# EAGLE design PowerShield v1-0 (EAGLE 6.5.0)
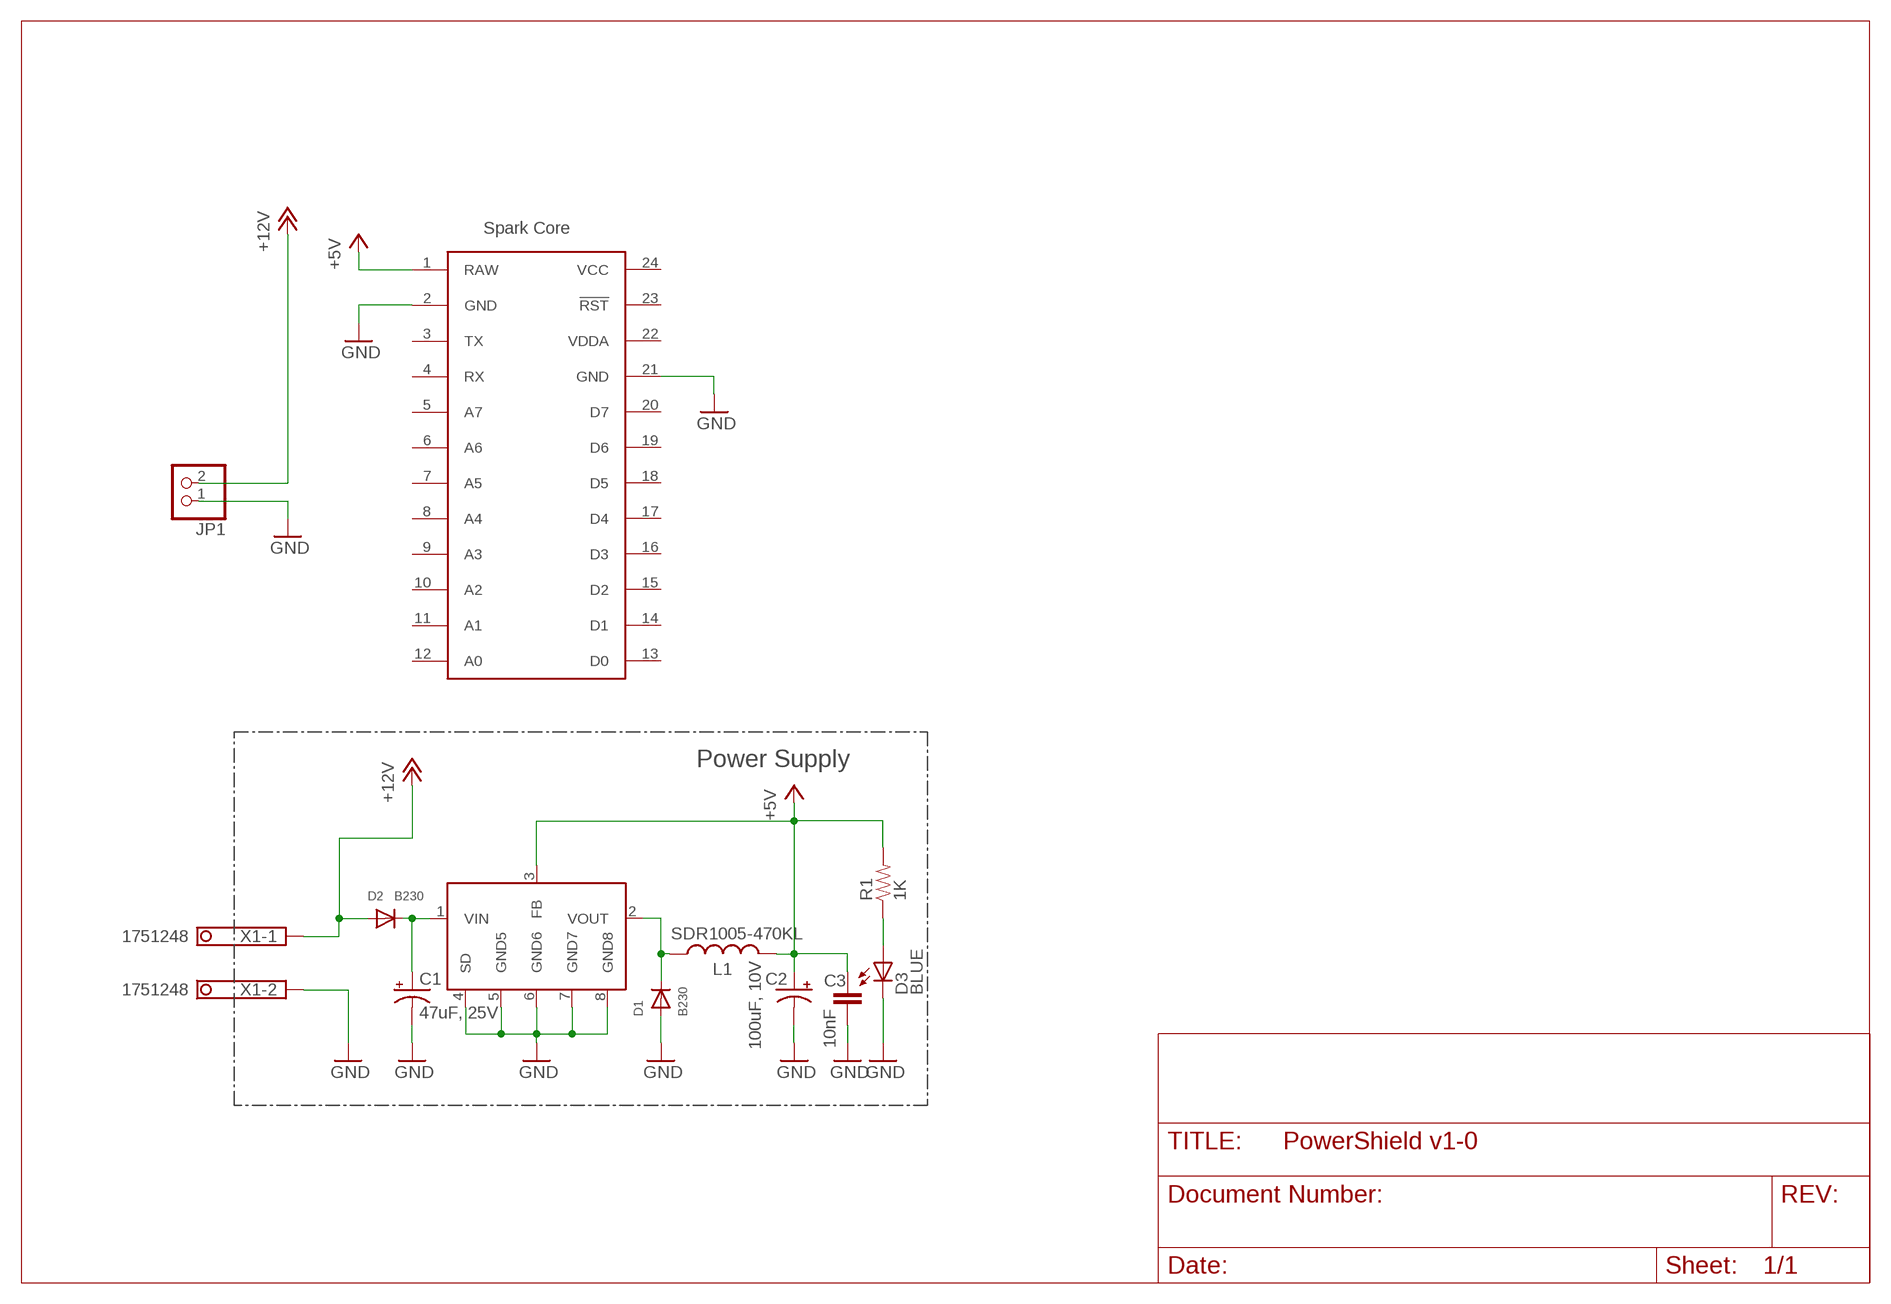
[diagram p0: schematic, sheet 1]

## Parts
C1  47uF, 25V  CAP_POLD  [PANASONIC_D]
C2  100uF, 10V  CAP_POLD  [PANASONIC_D]
C3  10nF  CAP0603-CAP  [0603-CAP]
D1  B230  DIODESMA  [SMADIODE]
D2  B230  DIODESMA  [SMADIODE]
D3  BLUE  LED0603  [LED-0603]
JP1  PINHD-1X2  [1X02]
L1  SDR1005-470KL  INDUCTOR-SPARKFUN  [INDUCTOR-SDR1005-470KL]
R1  1K  RESISTOR0603-RES  [0603-RES]
U1  AP1509-50SG-13  [SO08]
U$2  SPARK_CORECORE  [SPARK_CORE]
X1  1751248  [1751248]

## Nets
+5V: C2.+ C3.2 L1.P$2 R1.2 U1.3(FB) U$2.1(RAW)
+12V: D2.A JP1.2 X1.1
GND: C1.- C2.- C3.1 D1.A D3.C JP1.1 U1.4(SD) U1.5(GND5) U1.6(GND6) U1.7(GND7) U1.8(GND8) U$2.2(GND) U$2.21(GND) X1.2
N$1: D3.A R1.1
N$2: C1.+ D2.C U1.1(VIN)
N$34: D1.C L1.P$1 U1.2(VOUT)
Unconnected: U$2.3(TX) U$2.4(RX) U$2.5(A7) U$2.6(A6) U$2.7(A5) U$2.8(A4) U$2.9(A3) U$2.10(A2) U$2.11(A1) U$2.12(A0) U$2.13(D0) U$2.14(D1) U$2.15(D2) U$2.16(D3) U$2.17(D4) U$2.18(D5) U$2.19(D6) U$2.20(D7) U$2.23(!RST)

## Notes on the sheet
- Spark Core
- Power Supply

## Power pins joined to a net without a drawn wire
VCC: U$2.24(VCC)
VDDA: U$2.22(VDDA)

## Library data of the parts
C1 C2 = SparkFun-Capacitors:CAP_POL: Capacitor Polarized These are standard SMD and PTH capacitors. Normally 10uF, 47uF, and 100uF in electrolytic and tantalum varieties. Always verify the external diameter of the through hole cap, it varies with capacity, voltage, and manufacturer. The EIA devices should be standard.
C3 = SparkFun-Capacitors:CAP: Capacitor Standard 0603 ceramic capacitor, and 0.1" leaded capacitor.
D1 D2 = adafruit:DIODE: Diode SMADIODE - SMA Surface Mount Package 20V 1A Schottky Diode Digikey: 641-1014-6-ND DO-1N4148 - Through Hole Small Current Diode SOD-123 20V 1 A (.5mV Vf) Schottky Diode - Digikey: MBRX120TPMSCT-ND SOD-323 10V 570mA (.38mV Vf, 3ns) Schottky Diode - Digikey: ZLLS410CT-ND SOD-523 30V 30mA Schottky Diode (RB751S-40TE61) - Digikey: RB751S-40TE61CT-ND SOT23-R/W - SOT23 Package (R = Solder Paste/Reflow Ovens, W = Hand-Soldering) BAT54Film 40V 300mA - Digikey: 497-7162-1-ND
D3 = SparkFun-LED:LED: LEDs Standard schematic elements and footprints for 5mm, 3mm, 1206, and 0603 sized LEDs. 5mm - Spark Fun Electronics SKU : COM-00529 (and others)
JP1 = pinhead:PINHD-1X2: PIN HEADER
L1 = Spark:INDUCTOR-SPARKFUN: Inductors Basic Inductor/Choke - 0603 and 1206. Footprints are not proven and vary greatly between part numbers. SRN6045- 33uH, 20% 1.4A
R1 = SparkFun-Passives:RESISTOR: Resistor Basic schematic elements and footprints for 0603, 1206, and PTH resistors.
U1 = Spark:AP1509-50SG-13
U$2 = Spark:SPARK_CORE
X1 = con-phoenix-350:1751248: MKDS 1/ 2-3,5 Printklemme Nennstrom: 10 A Bemessungsspannung: 160 V Raster: 3,5 mm Polzahl: 2 Montageart: Löten Anschlussart: Schraubanschluss Anschlussrichtung vom Leiter zur Platine: 0° Source: http://eshop.phoenixcontact.com .. 1751248.pdf; OC_FARNELL: unknown; OC_NEWARK: unknown

## Board
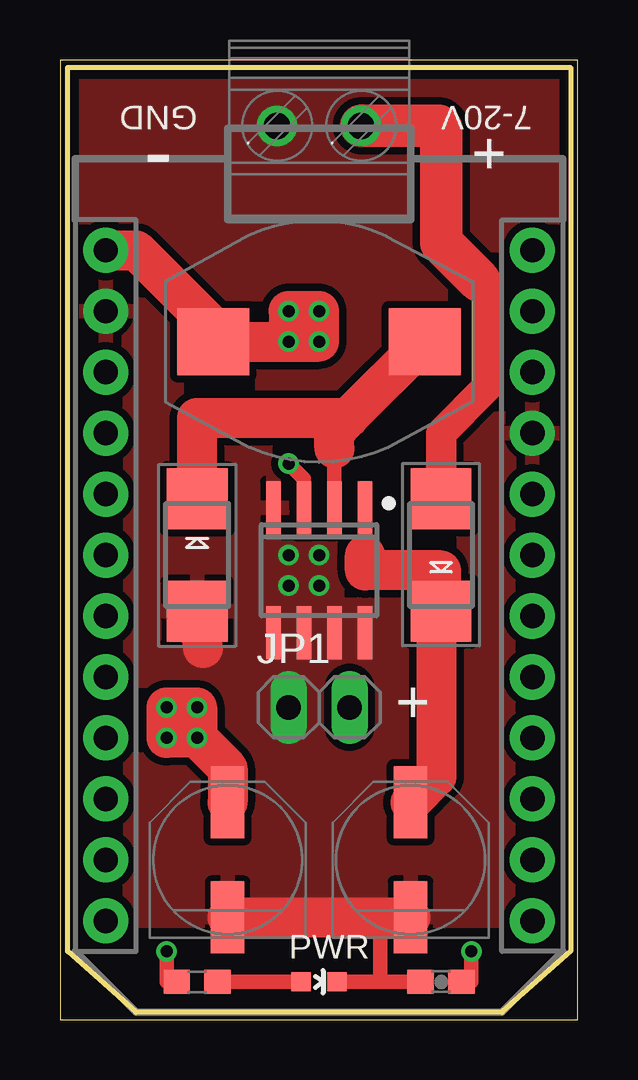
[diagram p1: board, top side]
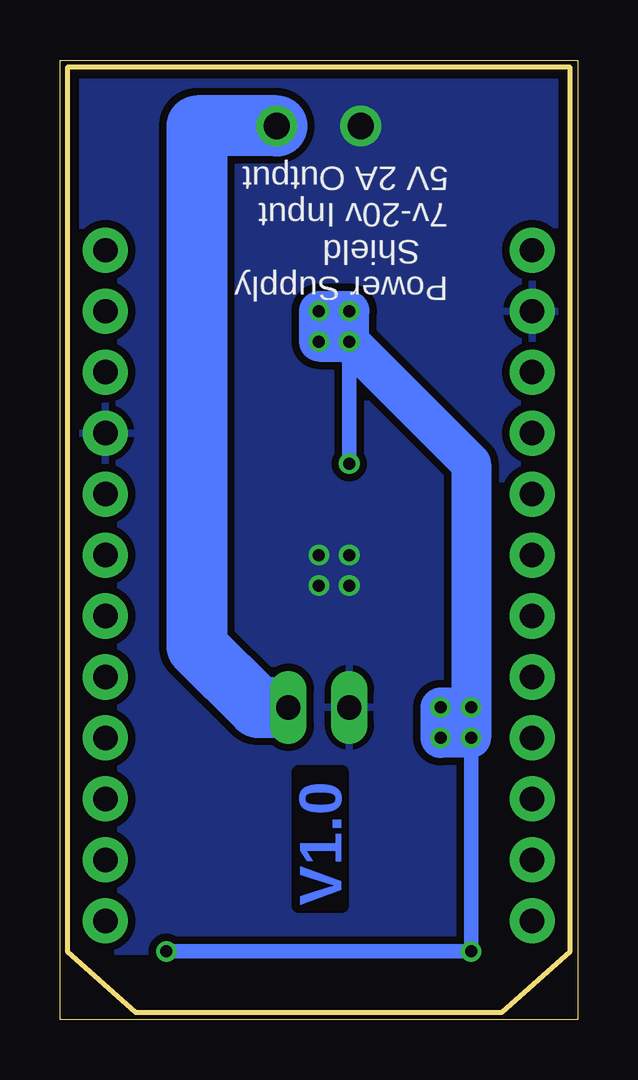
[diagram p2: board, bottom side, seen from below]

Size 21.58 x 39.99 mm. Coordinates in mm from the lower left corner, seen from the top.
Outline: 0,0 21.58,0 21.58,39.99 0,39.99 0,0
Outline: 0.32,39.69 21.27,39.69 21.27,2.86 18.41,0.32 3.17,0.32 0.32,2.86 0.32,39.69
Copper layers (1*16): Top 0.0356mm / dielectric 1.5011mm / Bottom 0.0356mm
Design rules "LaenPCBOrder *": minimum track width 6mil, minimum drill 13mil, track to track 6mil, track to pad 6mil, pad to pad 6mil, via to via 6mil, smd to smd 6mil, copper to edge 15mil, drill to drill 6mil, minimum pad ring 7mil, minimum via ring 7mil, stop-mask expansion 3mil, vias tented up to drill 21mil, thermal gap 10mil

### Footprints (pad centres in the part's own frame; a part is rotated, then mirrored left to right if it is on the bottom)
PANASONIC_D = smd 3 x 1.4: + 2.4,0; - -2.4,0
0603-CAP = smd 1.1 x 1: 1 -0.85,0; 2 0.85,0
SMADIODE = smd 2.54 x 2.54: A 2.349,0; C -2.349,0
LED-0603 = smd 0.8 x 0.8: A 0,-0.75; C 0,0.75
1X02 = drill 1.016 long: 1 -1.27,0; 2 1.27,0
INDUCTOR-SDR1005-470KL = smd 3 x 2.8: P$1 -4.4,0; P$2 4.4,0
0603-RES = smd 1.1 x 1: 1 -0.85,0; 2 0.85,0
SO08 = smd 0.6 x 2.2: 1 -1.905,-2.6; 2 -0.635,-2.6; 3 0.635,-2.6; 4 1.905,-2.6; 5 1.905,2.6; 6 0.635,2.6; 7 -0.635,2.6; 8 -1.905,2.6
SPARK_CORE = drill 1.016 pad 1.88: 1 -8.89,13.97; 2 -8.89,11.43; 3 -8.89,8.89; 4 -8.89,6.35; 5 -8.89,3.81; 6 -8.89,1.27; 7 -8.89,-1.27; 8 -8.89,-3.81; 9 -8.89,-6.35; 10 -8.89,-8.89; 11 -8.89,-11.43; 12 -8.89,-13.97; 13 8.89,-13.97; 14 8.89,-11.43; 15 8.89,-8.89; 16 8.89,-6.35; 17 8.89,-3.81; 18 8.89,-1.27; 19 8.89,1.27; 20 8.89,3.81; 21 8.89,6.35; 22 8.89,8.89; 23 8.89,11.43; 24 8.89,13.97
1751248 = drill 1.1 pad 1.7: 1 -1.75,-0.1; 2 1.75,-0.1

### Placement (x,y rotation side)
C1  14.61,6.67 90 top
C2  6.99,6.67 90 top
C3  15.88,1.59 0 top
D1  5.71,19.37 270 top
D2  15.88,19.37 90 top
D3  10.79,1.59 270 top
JP1  10.79,13.02 0 top
L1  10.79,28.26 180 top
R1  5.71,1.59 180 top
U1  10.79,18.73 180 top
U$2  10.79,18.1 0 top
X1  10.79,37.15 180 top

### Tracks (layer width: path | path; a pad name or v marks a point on that pad's centre or on a via)
+5V  (via drill 0.5)
  Top 0.61: 6.35,28.89 6.35,28.3 L1.P$2 | U1.3 10.16,22.54 v9.53,23.18 | R1.2 4.45,1.59 v4.45,2.86 | C3.2 17.14,1.59 v17.14,2.86
  Top 1.676: U$2.1 3.17,32.07 6.35,28.89 | L1.P$2 v9.53,28.26 | v9.53,28.26 v10.79,28.26 v10.79,29.53 v9.53,29.53 v9.53,28.26 | v4.45,13.02 v5.71,13.02 v5.71,11.75 | v5.71,11.75 v4.45,11.75 v4.45,13.02 | v4.45,13.02 v5.71,11.75 | v5.71,11.75 6.99,10.48 C2.+
  Bottom 0.61: v9.53,23.18 v9.53,28.26 | v4.45,11.75 v4.45,2.86 v17.14,2.86
  Bottom 1.676: v9.53,28.26 v9.53,29.53 v10.79,29.53 v10.79,28.26 v9.53,28.26 | v9.53,28.26 4.45,23.18 v4.45,13.02 | v4.45,13.02 v4.45,11.75 v5.71,11.75 v5.71,13.02 v4.45,13.02
+12V
  Top 1.27: D2.A 15.88,24.45 17.78,26.35 17.78,30.48 17.46,30.8
  Top 1.778: 17.46,30.8 15.88,32.38 15.88,37.15 15.78,37.25 X1.1
  Bottom 1.27: 12.7,13.02 JP1.2
  Bottom 2.54: X1.1 15.88,37.25 15.88,15.56 13.34,13.02 12.7,13.02
GND  (via drill 0.5)
  Top 0.254: C1.- 14.46,4.13 13.34,4.13
  Top 0.61: C3.1 13.34,1.59 | 13.34,1.59 D3.C | 13.34,4.13 13.34,1.59
  Top 1.676: C2.- C1.- | 5.96,15.5 D1.A
  other vias: 9.53,19.37 10.79,19.37 9.53,18.1 10.79,18.1
  pour Bottom (isolate 0.305): 0.64,39.69 20.95,39.69 20.95,2.86 0.64,2.86
  pour Top (isolate 0.305): 0.64,39.69 20.95,39.69 20.95,5.4 18.41,4.13 3.17,4.13 0.64,5.4
  pour Top (no thermals): 5.71,39.69 10.79,39.69 10.79,34.61 5.71,34.61
  pour Bottom (no thermals): 5.71,39.69 10.79,39.69 10.79,34.61 5.71,34.61
  pour Top (isolate 0.305, no thermals): 8.26,18.1 8.26,10.48 13.34,10.48 13.34,17.46 11.43,17.46 11.43,17.78 11.11,18.1
N$1
  Top 0.61: R1.1 D3.A
N$2
  Top 0.61: 12.7,19.37 U1.1
  Top 1.676: 12.7,19.37 12.7,18.73 15.88,18.73 D2.C 15.68,15.75 15.68,10.15 C1.+
N$34
  Top 0.61: U1.2 11.43,23.81
  Top 1.676: D1.C 5.71,25.08 12.02,25.08 | 12.02,25.08 L1.P$1 | 11.43,23.81 11.43,24.49 12.02,25.08

### Text on the board
Bottom: V1.0
tPlace: GND | 7-20V | - | + | + | PWR
bPlace: Power Supply / Shield / 7v-20v Input / 5V 2A Output